# Altium schematic sheet I2C_RTC_DS3231.SchDoc
size A4; SheetNumber: 5; SheetTotal: 16
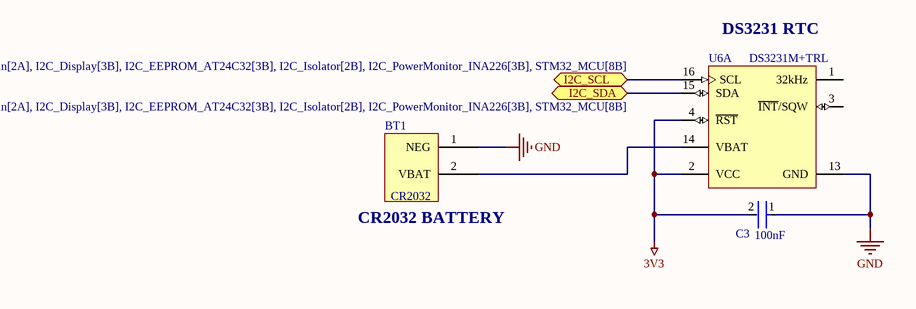
[diagram p0: I2C_RTC_DS3231.SchDoc]

## Parts
BT1  CR2032_HOLDER_TH  [CR2032_HOLDER_TH]  (value not drawn)
C3  100nF  [FP-CGA3E-0_3-0_1-IPC_A]
U6  DS3231M+TRL  [W16MK+1_N]  (part A of 2)

## Ports
I2C_SCL (bidir, see Main[2A], I2C_Display[3B], I2C_EEPROM_AT24C32[3B], I2C_Isolator[2B], I2C_PowerMonitor_INA226[3B], STM32_MCU[8B]), I2C_SDA (bidir, see Main[2A], I2C_Display[3B], I2C_EEPROM_AT24C32[3B], I2C_Isolator[2B], I2C_PowerMonitor_INA226[3B], STM32_MCU[8B])

## Nets
3V3: C3.2 U6.2(VCC) U6.4(~{RST})
GND: BT1.1(NEG) C3.1 U6.13(GND)
I2C_SCL: U6.16(SCL) ; port I2C_SCL
I2C_SDA: U6.15(SDA) ; port I2C_SDA
NetBT1_2: BT1.2(VBAT) U6.14(VBAT)

Not connected (* = marked no-connect by the designer): U6 1(32kHz) 3(~{INT}/SQW)

## Notes on the sheet
- (near U6) DS3231 RTC
- (near BT1) CR2032 BATTERY
- (in symbol CR2032_HOLDER_TH) CR2032

## Library data of the parts
C3 = CMP-2000-07546-2: Cap Ceramic 100nF 50V X7R 10% Pad SMD 0603 +125°C Automotive T/R; Weight: 7.1E-05oz; Composition: Ceramic; Max Operating Temperature: 125°C; Termination: SMD/SMT; Dielectric: X7R; Length: 1.6mm; Package Quantity: 1; REACH SVHC: No SVHC; Lead Free: Lead Free; Case Code (Metric): 1608; Min Operating Temperature: -55°C; Packaging: Tape and Reel; Tolerance: 10%; Voltage Rating: 50V; Case Code (Imperial): 0603; Capacitance: 100nF; Case/Package: 0603; Voltage Rating (DC): 50V; Depth: 0.8mm; Radiation Hardening: No; Ratings: AEC-Q200; Mount: Surface Mount; Voltage: 50V; Thickness: 0.035inch; Width: 0.8mm; Height: 0.8mm
U6 = CMP-0254-00002-2: +/-5ppm, MEMS based Real-Time Clock, I2C Interface, 16-Pin SO, -40 to 85 degC, Pb-Free, Reel; ComponentLink2URL: http://datasheets.maxim-ic.com/en/ds/DS3231M.pdf; PackageVersion: revD, 2010; ComponentLink3Description: Package Specification; Code_JEDEC: MS-013-AA; PackageDescription: 16-Pin Small-Outline IC, Wide (0.3in), 1.27 mm Pitch, SOIC (W), Pb-Free; ComponentLink1Description: Manufacturer URL; DatasheetVersion: Rev 3, Dec-2011; Code_IPC: SOIC127P1030-16; ComponentLink3URL: http://pdfserv.maxim-ic.com/package_dwgs/21-0042.PDF; PackageReference: W16MK+1; ComponentLink1URL: http://www.maxim-ic.com; ComponentLink2Description: Datasheet